# EAGLE design 12F1840_Controller_2020_03_04_A (EAGLE 9.1.0)
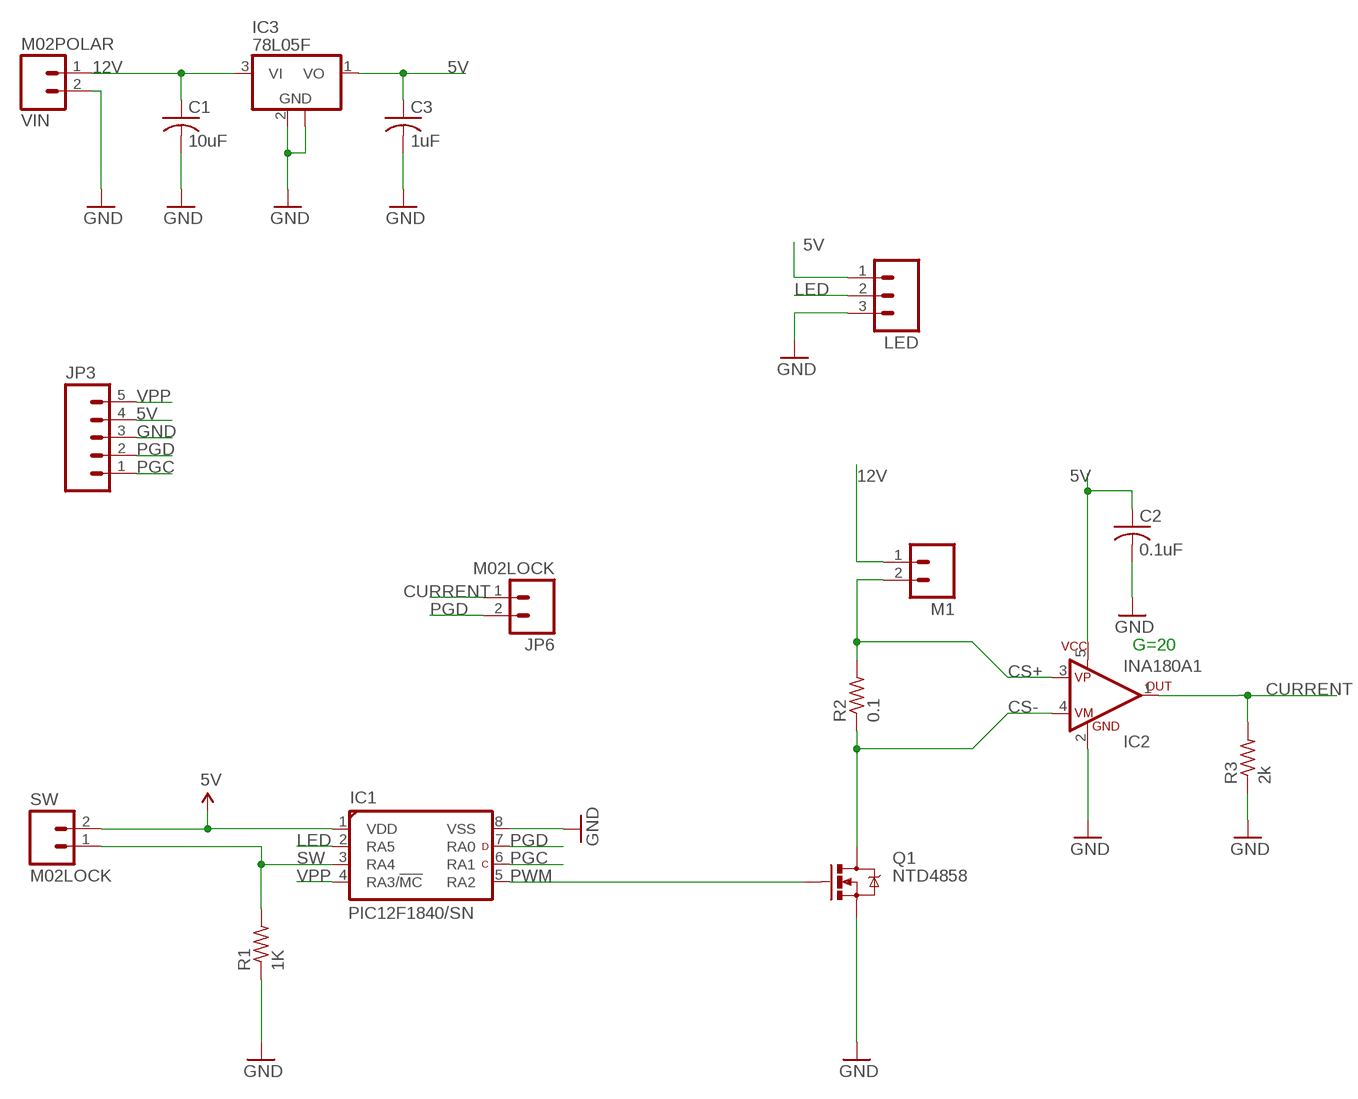
[diagram p0: schematic, sheet 1]

## Parts
C1  10uF  C-USC1206  [C1206]
C2  0.1uF  C-USC1206  [C1206]
C3  1uF  C-USC1206  [C1206]
IC1  PIC12F1840/SN  [SOIC8-SN]
IC2  INA180A1  CS30  [SOT23-5]
IC3  78L05F  [SOT89]
JP3  M05LOCK  [1X05_LOCK]
JP6  M02LOCK  [1X02_LOCK]
LED  M03PTH  [1X03]
M1  M02POLAR  [MOLEX-1X2]
Q1  NTD4858  MOSFET-NCHANNELFDD8780  [DPAK]
R1  1K  R-US_R1206  [R1206]
R2  0.1  R-US_R2512  [R2512]
R3  2k  R-US_R1206  [R1206]
SW  M02LOCK  [1X02_LOCK]
VIN  M02POLAR  [MOLEX-1X2]

## Nets
5V: C2.1 C3.1 IC1.1(VDD) IC2.5(V+) IC3.1(VO) JP3.4 LED.1 SW.2
12V: C1.1 IC3.3(VI) M1.1 VIN.1
CS+: IC2.3(VP) M1.2 R2.2
CS-: IC2.4(VM) Q1.4(D) R2.1
CURRENT: IC2.1(OUT) JP6.1 R3.2
GND: C1.2 C2.2 C3.2 IC1.8(VSS) IC2.2(V-) IC3.2(GND) IC3.2@1(GND) JP3.3 LED.3 Q1.3(S) R1.1 R3.1 VIN.2
LED: IC1.2(RA5) LED.2
PGC: IC1.6(RA1) JP3.1
PGD: IC1.7(RA0) JP3.2 JP6.2
PWM: IC1.5(RA2) Q1.1(G)
SW: IC1.3(RA4) R1.2 SW.1
VPP: IC1.4(RA3/!MC!) JP3.5

## Notes on the sheet
- G=20

## Library data of the parts
C1-C3 = rcl:C-US: CAPACITOR, American symbol; SPICEPREFIX: C
IC1 = microchip_pic12f:PIC12*F1840: Low pincount microcontroller http://www.microchip.com/wwwproducts/Devices.aspx?product=PIC12F1840 Properties Parameter Name Value Program Memory Type Flash Program Memory (KB) 7 CPU Speed (MIPS) 8 RAM Bytes 256 Data EEPROM (bytes) 256 Digital Communication Peripherals 1-UART, 1-A/E/USART, 1-SPI, 1-I2C1-MSSP(SPI/I2C) Capture/Compare/PWM Peripherals 1 ECCP / Timers 2 x 8-bit, 1 x 16-bit ADC 4 ch, 10-bit Comparators 1 Temperature Range (C) -40 to 125 Operating Voltage Range (V) 1.8 to 5.5 Pin Count 8 XLP Yes Cap Touch Channels 4 Features Enhanced Mid-range Core with 49 Instruction, 16 Stack Levels Flash Program Memory with self read/write capability Internal 32MHz oscillator Integrated Capacitive mTouch Sensing Module Data Signal Modulator Module MI2C, SPI, EUSART w/auto baud ECCP (Enhanced/Capture Compare PWM) Module Comparator with selectable Voltage Reference 4 Channel 10b ADC with Voltage Reference 25mA Source/Sink current I/O Two 8-bit Timers (TMR0/TMR2) One 16-bit Timer (TMR1) Extended Watchdog Timer (EWDT) Enhanced Power-On/Off-Reset Brown-Out Reset (BOR) In Circuit Serial Programming (ICSP) On Board In-Circuit Debug Wide Operating Voltage (1.8V – 5.5V) Low Power PIC12LF182x variants (1.8V – 3.6V) Standby Current (PIC12LF1840): 20 nA @ 1.8V, typical Active Current (PIC12LF1840): 50uA/MHz @ 1.8V, typical Library from www.mikroelektroniikka.fi/lbr
IC2 = CS30:CS30
IC3 = linear:78L*: POSITOIV-VOLTAGE REGULATORS Output up to 100 mA Source: Datasheet <http://focus.ti.com/lit/ds/symlink/ua78l05.pdf>
JP3 = SparkFun-Connectors:M05: Header 5 Standard 5-pin 0.1" header. Use with straight break away headers (SKU : PRT-00116), right angle break away headers (PRT-00553), swiss pins (PRT-00743), machine pins (PRT-00117), and female headers (PRT-00115). Molex polarized connector foot print use with SKU : PRT-08230 with associated crimp pins and housings.
JP6 M1 SW VIN = SparkFun-Connectors:M02: Standard 2-pin 0.1" header. Use with - straight break away headers ( PRT-00116) - right angle break away headers (PRT-00553) - swiss pins (PRT-00743) - machine pins (PRT-00117) - female headers (PRT-00115) Molex polarized connector foot print use with: PRT-08233 with associated crimp pins and housings. 2.54_SCREWTERM for use with PRT-10571. 3.5mm Screw Terminal footprints for PRT-08084 5mm Screw Terminal footprints for use with PRT-08432
LED = SparkFun-Connectors:M03: Header 3 Standard 3-pin 0.1" header. Use with straight break away headers (SKU : PRT-00116), right angle break away headers (PRT-00553), swiss pins (PRT-00743), machine pins (PRT-00117), and female headers (PRT-00115). Molex polarized connector foot print use with SKU : PRT-08232 with associated crimp pins and housings.
Q1 = SparkFun-DiscreteSemi:MOSFET-NCHANNEL: Common NMOSFET Parts MFG P/N Store ID Prod ID FDD8780 TRANS-09984 SI7820DN TRANS-11055 FDS6630A IC-08089 2N7002PW TRANS-11151 FQP30N06L COM-10213 TRANS-10060 BSS123LT1G TRANS-08345 BSS138 TRANS-00830 BS170 2N7000; PROD_ID: TRANS-09984
R1-R3 = resistor:R-US_: RESISTOR, American symbol

## Board
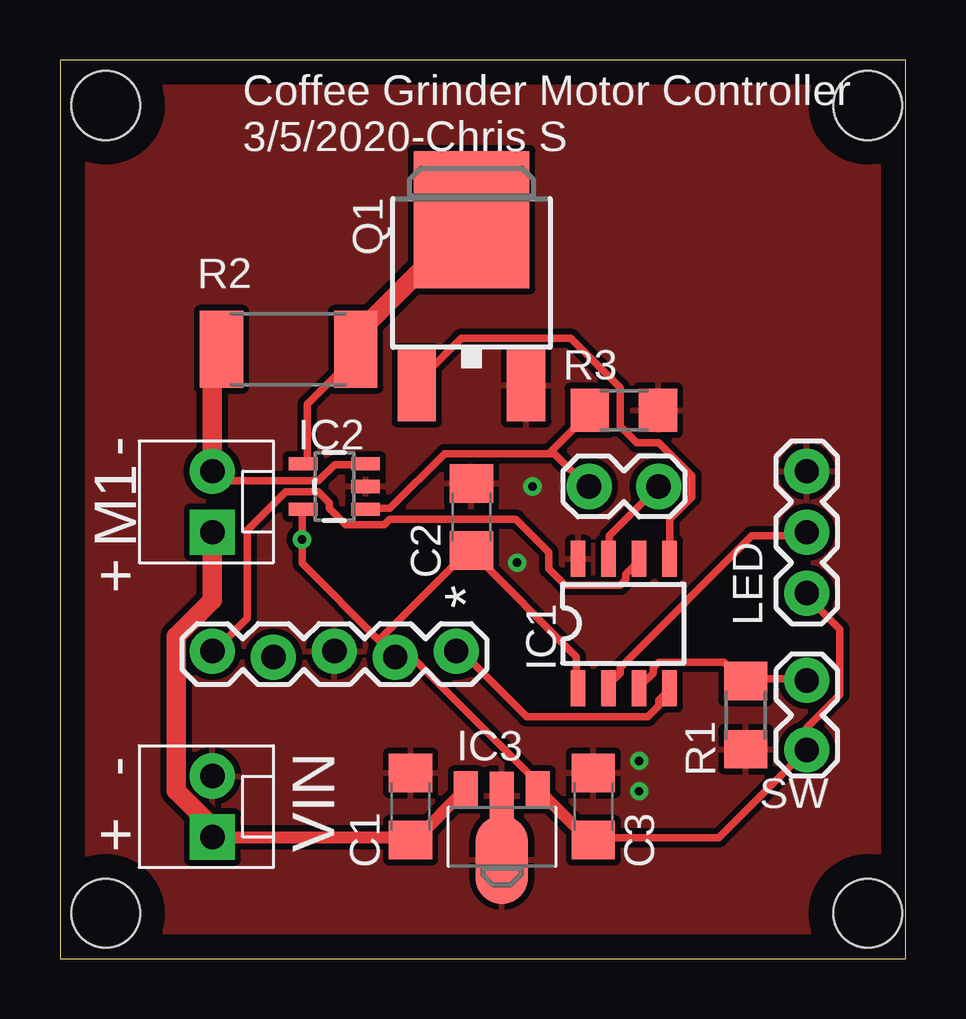
[diagram p1: board, top side]
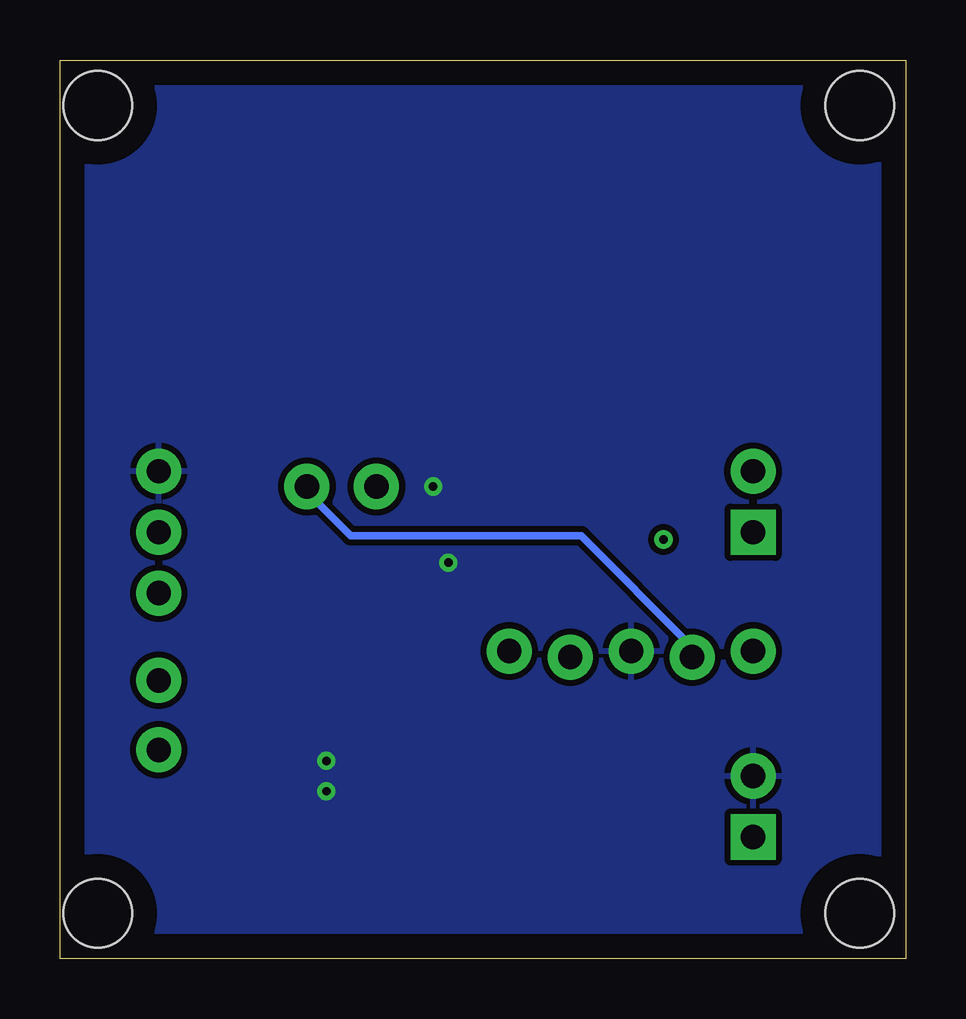
[diagram p2: board, bottom side, seen from below]

Size 35.23 x 37.45 mm. Coordinates in mm from the lower left corner, seen from the top.
Outline: 0,0 35.23,0 35.23,37.45 0,37.45 0,0
Copper layers (1*16): Top 0.035mm / dielectric 1.5mm / Bottom 0.035mm
Design rules "default": minimum track width 12mil, minimum drill 0.35mm, track to track 6mil, track to pad 6mil, pad to pad 6mil, via to via 6mil, smd to smd 6mil, copper to edge 40mil, drill to drill 6mil, minimum pad ring 10mil, minimum via ring 8mil, stop-mask expansion 4mil, vias tented up to drill 0mil, thermal gap 10mil
Holes 2.87 mm at 33.66,1.91 1.9,1.91 1.9,35.56 33.66,35.56

### Footprints (pad centres in the part's own frame; a part is rotated, then mirrored left to right if it is on the bottom)
C1206 = smd 1.6 x 1.8: 1 -1.4,0; 2 1.4,0
SOIC8-SN = smd 0.6 x 1.5: 1 -1.905,-2.7; 2 -0.635,-2.7; 3 0.635,-2.7; 4 1.905,-2.7; 5 1.905,2.7; 6 0.635,2.7; 7 -0.635,2.7; 8 -1.905,2.7
SOT23-5 = smd 0.55 x 1.2: 1 -0.95,-1.3; 2 0,-1.3; 3 0.95,-1.3; 4 0.95,1.3; 5 -0.95,1.3
SOT89 = smd 1 x 1.5: 1 -1.499,-1.981; 3 1.499,-1.981 | smd 1 x 2: 2 0,-1.727 | smd 2.2 x 3.7: 2@1 0,0.94
1X05_LOCK = drill 1.016 pad 1.88: 1 0,0.127; 2 2.54,-0.127; 3 5.08,0.127; 4 7.62,-0.127; 5 10.16,0.127
1X02_LOCK = drill 1.016 pad 1.88: 1 -0.178,0; 2 2.718,0
1X03 = drill 1.016 pad 1.88: 1 0,0; 2 2.54,0; 3 5.08,0
MOLEX-1X2 = drill 1.016 pad 1.88 square: 1 0,0 | drill 1.016 pad 1.88: 2 2.54,0
DPAK = smd 1.6 x 3: 1 -2.28,-5.31; 3 2.28,-5.31 | smd 4.826 x 5.715: 4 0,1.588
R1206 = smd 1.6 x 1.803: 1 -1.422,0; 2 1.422,0
R2512 = smd 1.8 x 3.2: 1 -2.8,0; 2 2.8,0

### Placement (x,y rotation side)
C1  14.6,6.35 90 top
C2  17.14,18.41 90 top
C3  22.22,6.35 90 top
IC1  23.49,13.97 0 top
IC2  11.43,19.69 90 top
IC3  18.41,5.08 180 top
JP3  6.35,12.7 0 top
JP6  22.22,19.69 0 top
LED  31.11,15.24 90 top
M1  6.35,17.78 90 top
Q1  17.14,29.21 0 top
R1  28.58,10.16 90 top
R2  9.52,25.4 180 top
R3  23.49,22.86 180 top
SW  31.11,11.43 270 top
VIN  6.35,5.08 90 top

### Tracks (layer width: path | path; a pad name or v marks a point on that pad's centre or on a via)
5V  (via drill 0.35)
  Top 0.152: 19.99,6.96 IC3.1 19.84,7.11 | 22.12,4.83 C3.1 | 10.24,18.69 IC2.5 10.08,18.69 | 21.51,11.38 IC1.1 | 17.09,16.87 C2.1 17.09,16.87
  Top 0.305: LED.1 31.11,15.11 32.49,13.74 32.49,11 31.11,9.63 SW.2 27.46,5.05 22.43,5.05 C3.1 | IC1.1 21.51,11.45 21.51,12.6 17.17,16.94 C2.1 16.94,16.94 13.28,13.28 | IC2.5 10.08,18.54 10.08,17.63 v10.08,17.48 10.08,17.4 10.08,16.48 13.28,13.28 | 13.28,13.28 13.97,12.6 JP3.4 13.97,12.37 14.88,12.37 19.68,7.57 19.68,7.11 IC3.1
  Top 0.508: IC3.1 22.02,4.95 C3.1
12V
  Top 0.152: 16.79,6.96 IC3.3 | 14.66,4.83 C1.1 14.57,4.96 14.5,4.98 | 6.73,4.98 VIN.1
  Top 0.508: VIN.1 14.45,5.08 14.57,4.96 | C1.1 14.8,4.95 IC3.3
  Top 0.813: VIN.1 6.35,5.5 4.85,7 4.85,13.45 6.35,14.95 M1.1
CS+
  Top 0.152: 12.67,20.52 IC2.3 12.67,20.52 | 6.58,20.07 M1.2 6.58,20.07
  Top 0.305: IC2.3 12.6,20.6 11.45,20.6 10.77,19.91 6.88,19.91 6.65,20.14 M1.2
  Top 0.813: M1.2 6.35,25.02 R2.2
CS-
  Top 0.152: 10.24,20.68 IC2.4
  Top 0.305: IC2.4 10.31,20.83 10.31,23.11 12.37,25.17 R2.1 12.37,25.4 12.7,25.4
  Top 0.813: Q1.4 12.7,26.35 12.7,25.4
CURRENT
  Top 0.152: 12.83,18.69 IC2.1 12.83,18.69 | 22.12,22.81 R3.2 22.12,22.81
  Top 0.305: 20.37,21.06 20.6,21.06 21.97,19.69 JP6.1 | 20.37,21.06 16.03,21.06 13.74,18.77 12.83,18.77 IC2.1 | 20.37,21.06 21.97,22.66 R3.2
GND  (via drill 0.35)
  other vias: 19.05,16.51 24.13,8.26 24.13,6.98 19.68,19.69
  pour Top (isolate 0.254): -1.27,38.1 37.47,38.1 37.47,-1.27 -1.27,-1.27
  pour Bottom (isolate 0.254): -0.64,36.83 39.37,36.83 39.37,-1.27 -1.27,-1.27 -1.27,36.83
LED
  Top 0.152: 22.88,11.23 IC1.2 22.88,11.38
  Top 0.305: IC1.2 22.88,11.45 23.34,11.91 23.34,12.14 28.83,17.63 31.11,17.63 LED.2
PGC
  Top 0.152: 24.1,16.71 IC1.6 24.1,16.71
  Top 0.305: IC1.6 24.03,16.48 23.57,16.03 23.57,15.8 23.34,15.57 21.06,15.57 20.37,16.26 20.37,16.94 19,18.31 13.74,18.31 13.51,18.09 11.91,18.09 11.23,18.77 11.23,19 10.77,19.46 9.4,19.46 7.8,17.86 7.8,14.2 6.43,12.83 JP3.1
PGD
  Top 0.152: 22.88,16.56 IC1.7 22.88,16.56
  Top 0.305: JP6.2 22.88,17.63 22.88,16.71 IC1.7
  Bottom 0.305: JP6.2 24.94,19.46 23.11,17.63 13.51,17.63 8.94,13.06 8.94,12.6 JP3.2
PWM
  Top 0.152: 25.32,16.71 IC1.5 25.32,16.71 | 14.96,24.03 Q1.1 14.96,24.03
  Top 0.305: IC1.5 25.4,16.71 25.4,18.31 26.31,19.23 26.31,20.14 24.94,21.51 24.03,21.51 23.34,22.2 23.34,23.8 21.28,25.86 16.71,25.86 14.88,24.03 Q1.1
SW
  Top 0.152: 24.26,11.38 IC1.3 | R1.2 28.52,11.68 R1.2 | R1.2 28.68,11.68 R1.2 | 31.11,11.68 SW.1
  Top 0.305: IC1.3 24.26,11.45 24.71,11.91 24.71,12.14 24.94,12.37 27.69,12.37 28.37,11.68 R1.2 28.6,11.68 31.11,11.68 SW.1
VPP
  Top 0.305: IC1.4 25.4,11.23 24.94,10.77 24.94,10.54 24.49,10.08 19.46,10.08 16.71,12.83 JP3.5

### Text on the board
tPlace: Coffee Grinder Motor Controller / 3/5/2020-Chris S | - | M1 | + | * | - | + | VIN